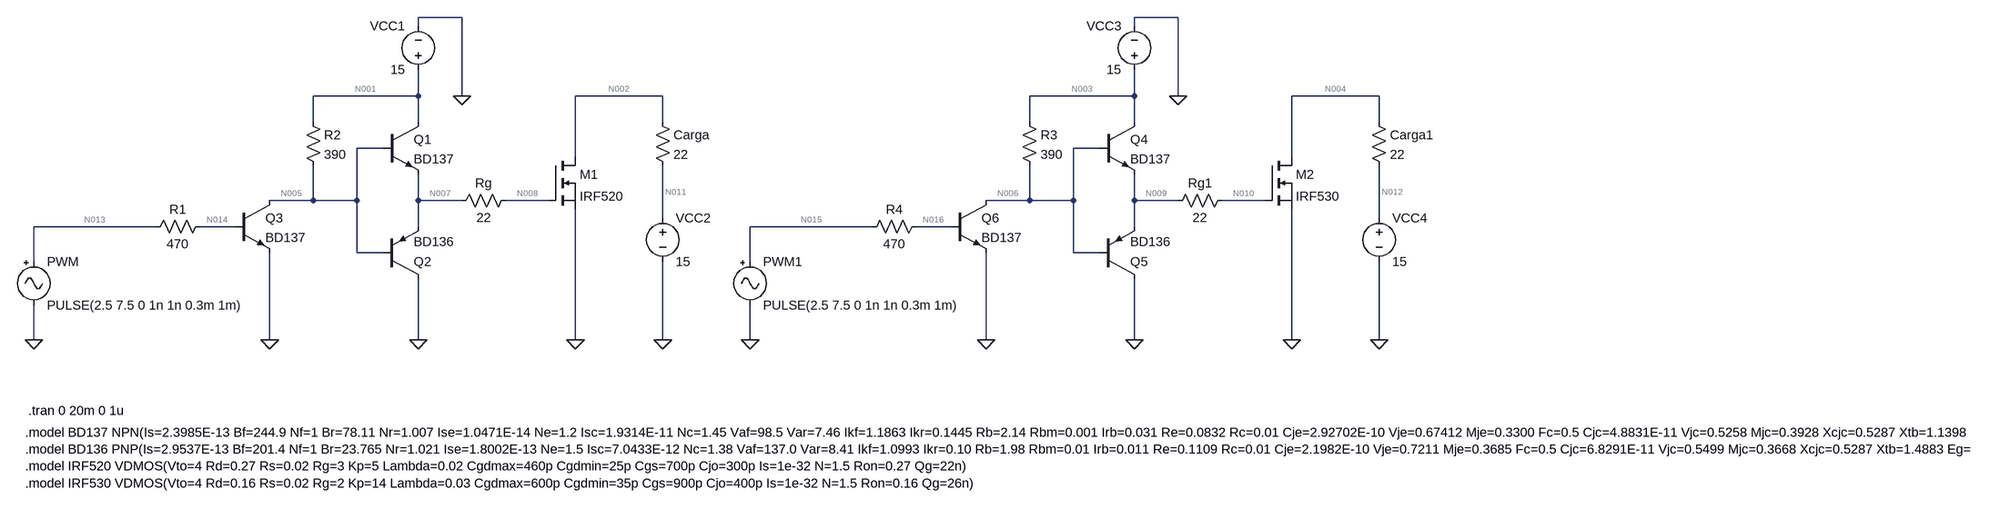
[diagram p0: schematic 1.asc]
1.asc, the LTspice schematic file:
Version 4
SHEET 1 3628 2340
WIRE 240 -144 160 -144
WIRE 1552 -144 1472 -144
WIRE 160 -128 160 -144
WIRE 1472 -128 1472 -144
WIRE 160 0 160 -48
WIRE 160 0 -32 0
WIRE 240 0 240 -144
WIRE 608 0 448 0
WIRE 1472 0 1472 -48
WIRE 1472 0 1280 0
WIRE 1552 0 1552 -144
WIRE 1920 0 1760 0
WIRE -32 48 -32 0
WIRE 160 48 160 0
WIRE 608 48 608 0
WIRE 1280 48 1280 0
WIRE 1472 48 1472 0
WIRE 1920 48 1920 0
WIRE 96 96 48 96
WIRE 1408 96 1360 96
WIRE 448 112 448 0
WIRE 1760 112 1760 0
WIRE -32 192 -32 128
WIRE -32 192 -112 192
WIRE 48 192 48 96
WIRE 48 192 -32 192
WIRE 160 192 160 144
WIRE 240 192 160 192
WIRE 400 192 320 192
WIRE 1280 192 1280 128
WIRE 1280 192 1200 192
WIRE 1360 192 1360 96
WIRE 1360 192 1280 192
WIRE 1472 192 1472 144
WIRE 1552 192 1472 192
WIRE 1712 192 1632 192
WIRE 608 224 608 128
WIRE 1920 224 1920 128
WIRE -320 240 -544 240
WIRE -176 240 -240 240
WIRE 160 240 160 192
WIRE 992 240 768 240
WIRE 1136 240 1072 240
WIRE 1472 240 1472 192
WIRE 48 288 48 192
WIRE 96 288 48 288
WIRE 1360 288 1360 192
WIRE 1408 288 1360 288
WIRE -544 304 -544 240
WIRE 768 304 768 240
WIRE -544 448 -544 384
WIRE -112 448 -112 288
WIRE 160 448 160 336
WIRE 448 448 448 208
WIRE 608 448 608 304
WIRE 768 448 768 384
WIRE 1200 448 1200 288
WIRE 1472 448 1472 336
WIRE 1760 448 1760 208
WIRE 1920 448 1920 304
FLAG 160 448 0
FLAG -112 448 0
FLAG 448 448 0
FLAG 240 0 0
FLAG 608 448 0
FLAG -544 448 0
FLAG 1472 448 0
FLAG 1200 448 0
FLAG 1760 448 0
FLAG 1552 0 0
FLAG 1920 448 0
FLAG 768 448 0
SYMBOL npn 96 48 R0
SYMATTR InstName Q1
SYMATTR Value BD137
SYMBOL pnp 96 336 M180
SYMATTR InstName Q2
SYMATTR Value BD136
SYMBOL res -48 32 R0
SYMATTR InstName R2
SYMATTR Value 390
SYMBOL npn -176 192 R0
SYMATTR InstName Q3
SYMATTR Value BD137
SYMBOL res -224 224 R90
WINDOW 0 0 56 VBottom 2
WINDOW 3 32 56 VTop 2
SYMATTR InstName R1
SYMATTR Value 470
SYMBOL voltage 160 -32 R180
WINDOW 0 24 96 Left 2
WINDOW 3 24 16 Left 2
SYMATTR InstName VCC1
SYMATTR Value 15
SYMBOL res 336 176 R90
WINDOW 0 0 56 VBottom 2
WINDOW 3 32 56 VTop 2
SYMATTR InstName Rg
SYMATTR Value 22
SYMBOL nmos 400 112 R0
SYMATTR InstName M1
SYMATTR Value IRF520
SYMBOL res 592 32 R0
SYMATTR InstName Carga
SYMATTR Value 22
SYMBOL voltage 608 208 R0
SYMATTR InstName VCC2
SYMATTR Value 15
SYMBOL Misc\\signal -544 288 R0
WINDOW 123 0 0 Left 0
WINDOW 39 0 0 Left 0
SYMATTR InstName PWM
SYMATTR Value PULSE(2.5 7.5 0 1n 1n 0.3m 1m)
SYMBOL npn 1408 48 R0
SYMATTR InstName Q4
SYMATTR Value BD137
SYMBOL pnp 1408 336 M180
SYMATTR InstName Q5
SYMATTR Value BD136
SYMBOL res 1264 32 R0
SYMATTR InstName R3
SYMATTR Value 390
SYMBOL npn 1136 192 R0
SYMATTR InstName Q6
SYMATTR Value BD137
SYMBOL res 1088 224 R90
WINDOW 0 0 56 VBottom 2
WINDOW 3 32 56 VTop 2
SYMATTR InstName R4
SYMATTR Value 470
SYMBOL voltage 1472 -32 R180
WINDOW 0 24 96 Left 2
WINDOW 3 24 16 Left 2
SYMATTR InstName VCC3
SYMATTR Value 15
SYMBOL res 1648 176 R90
WINDOW 0 0 56 VBottom 2
WINDOW 3 32 56 VTop 2
SYMATTR InstName Rg1
SYMATTR Value 22
SYMBOL nmos 1712 112 R0
SYMATTR InstName M2
SYMATTR Value IRF530
SYMBOL res 1904 32 R0
SYMATTR InstName Carga1
SYMATTR Value 22
SYMBOL voltage 1920 208 R0
SYMATTR InstName VCC4
SYMATTR Value 15
SYMBOL Misc\\signal 768 288 R0
WINDOW 123 0 0 Left 0
WINDOW 39 0 0 Left 0
SYMATTR InstName PWM1
SYMATTR Value PULSE(2.5 7.5 0 1n 1n 0.3m 1m)
TEXT -554 584 Left 2 !.tran 0 20m 0 1u
TEXT -560 624 Left 2 !.model BD137 NPN(Is=2.3985E-13 Bf=244.9 Nf=1 Br=78.11 Nr=1.007 Ise=1.0471E-14 Ne=1.2 Isc=1.9314E-11 Nc=1.45 Vaf=98.5 Var=7.46 Ikf=1.1863 Ikr=0.1445 Rb=2.14 Rbm=0.001 Irb=0.031 Re=0.0832 Rc=0.01 Cje=2.92702E-10 Vje=0.67412 Mje=0.3300 Fc=0.5 Cjc=4.8831E-11 Vjc=0.5258 Mjc=0.3928 Xcjc=0.5287 Xtb=1.1398 Eg=1.2105 Xti=3.0)\n.model BD136 PNP(Is=2.9537E-13 Bf=201.4 Nf=1 Br=23.765 Nr=1.021 Ise=1.8002E-13 Ne=1.5 Isc=7.0433E-12 Nc=1.38 Vaf=137.0 Var=8.41 Ikf=1.0993 Ikr=0.10 Rb=1.98 Rbm=0.01 Irb=0.011 Re=0.1109 Rc=0.01 Cje=2.1982E-10 Vje=0.7211 Mje=0.3685 Fc=0.5 Cjc=6.8291E-11 Vjc=0.5499 Mjc=0.3668 Xcjc=0.5287 Xtb=1.4883 Eg=1.2343 Xti=3.0)\n.model IRF520 VDMOS(Vto=4 Rd=0.27 Rs=0.02 Rg=3 Kp=5 Lambda=0.02 Cgdmax=460p Cgdmin=25p Cgs=700p Cjo=300p Is=1e-32 N=1.5 Ron=0.27 Qg=22n)\n.model IRF530 VDMOS(Vto=4 Rd=0.16 Rs=0.02 Rg=2 Kp=14 Lambda=0.03 Cgdmax=600p Cgdmin=35p Cgs=900p Cjo=400p Is=1e-32 N=1.5 Ron=0.16 Qg=26n)

The netlist it stands for:
* 1.asc
Q1 N001 N005 N007 0 BD137
Q2 0 N005 N007 0 BD136
R2 N001 N005 390
Q3 N005 N014 0 0 BD137
R1 N014 N013 470
VCC1 N001 0 15
Rg N008 N007 22
M1 N002 N008 0 0 IRF520
R§Carga N002 N011 22
VCC2 N011 0 15
V§PWM N013 0 PULSE(2.5 7.5 0 1n 1n 0.3m 1m)
Q4 N003 N006 N009 0 BD137
Q5 0 N006 N009 0 BD136
R3 N003 N006 390
Q6 N006 N016 0 0 BD137
R4 N016 N015 470
VCC3 N003 0 15
Rg1 N010 N009 22
M2 N004 N010 0 0 IRF530
R§Carga1 N004 N012 22
VCC4 N012 0 15
V§PWM1 N015 0 PULSE(2.5 7.5 0 1n 1n 0.3m 1m)
.model NPN NPN
.model PNP PNP
.lib standard.bjt
.model NMOS NMOS
.model PMOS PMOS
.lib standard.mos
.tran 0 20m 0 1u
.model BD137 NPN(Is=2.3985E-13 Bf=244.9 Nf=1 Br=78.11 Nr=1.007 Ise=1.0471E-14 Ne=1.2 Isc=1.9314E-11 Nc=1.45 Vaf=98.5 Var=7.46 Ikf=1.1863 Ikr=0.1445 Rb=2.14 Rbm=0.001 Irb=0.031 Re=0.0832 Rc=0.01 Cje=2.92702E-10 Vje=0.67412 Mje=0.3300 Fc=0.5 Cjc=4.8831E-11 Vjc=0.5258 Mjc=0.3928 Xcjc=0.5287 Xtb=1.1398 Eg=1.2105 Xti=3.0)
.model BD136 PNP(Is=2.9537E-13 Bf=201.4 Nf=1 Br=23.765 Nr=1.021 Ise=1.8002E-13 Ne=1.5 Isc=7.0433E-12 Nc=1.38 Vaf=137.0 Var=8.41 Ikf=1.0993 Ikr=0.10 Rb=1.98 Rbm=0.01 Irb=0.011 Re=0.1109 Rc=0.01 Cje=2.1982E-10 Vje=0.7211 Mje=0.3685 Fc=0.5 Cjc=6.8291E-11 Vjc=0.5499 Mjc=0.3668 Xcjc=0.5287 Xtb=1.4883 Eg=1.2343 Xti=3.0)
.model IRF520 VDMOS(Vto=4 Rd=0.27 Rs=0.02 Rg=3 Kp=5 Lambda=0.02 Cgdmax=460p Cgdmin=25p Cgs=700p Cjo=300p Is=1e-32 N=1.5 Ron=0.27 Qg=22n)
.model IRF530 VDMOS(Vto=4 Rd=0.16 Rs=0.02 Rg=2 Kp=14 Lambda=0.03 Cgdmax=600p Cgdmin=35p Cgs=900p Cjo=400p Is=1e-32 N=1.5 Ron=0.16 Qg=26n)
.backanno
.end

* Results of the author's LTspice run, read from the files saved beside the schematic
* Operating Point, zero values left out:
*   V(n001) = 15 V
*   V(n005) = 14.42 mV
*   V(n007) = 19.55 mV
*   V(n014) = 713.2 mV
*   V(n013) = 2.5 V
*   V(n008) = 19.55 mV
*   V(n002) = 15 V
*   V(n011) = 15 V
*   V(n003) = 15 V
*   V(n006) = 14.42 mV
*   V(n009) = 19.55 mV
*   V(n016) = 713.2 mV
*   V(n015) = 2.5 V
*   V(n010) = 19.55 mV
*   V(n004) = 15 V
*   V(n012) = 15 V
*   Ic(Q5) = -2.549 pA
*   Ib(Q5) = 2.329 pA
*   Ic(Q2) = -2.549 pA
*   Ib(Q2) = 2.329 pA
*   Ic(Q6) = 38.42 mA
*   Ib(Q6) = 3.802 mA
*   Ie(Q6) = -42.23 mA
*   Ic(Q4) = 34.64 pA
*   Ib(Q4) = -34.31 pA
*   Ic(Q3) = 38.42 mA
*   Ib(Q3) = 3.802 mA
*   Ie(Q3) = -42.23 mA
*   Ic(Q1) = 34.64 pA
*   Ib(Q1) = -34.31 pA
*   Id(M2) = 15 pA
*   Is(M2) = -15 pA
*   Id(M1) = 15 pA
*   Is(M1) = -15 pA
*   I(Carga1) = -30 pA
*   I(R4) = -3.802 mA
*   I(R3) = 38.42 mA
*   I(Carga) = -30 pA
*   I(R1) = -3.802 mA
*   I(R2) = 38.42 mA
*   I(Pwm1) = -3.802 mA
*   I(Vcc4) = -30 pA
*   I(Vcc3) = -38.42 mA
*   I(Pwm) = -3.802 mA
*   I(Vcc2) = -30 pA
*   I(Vcc1) = -38.42 mA
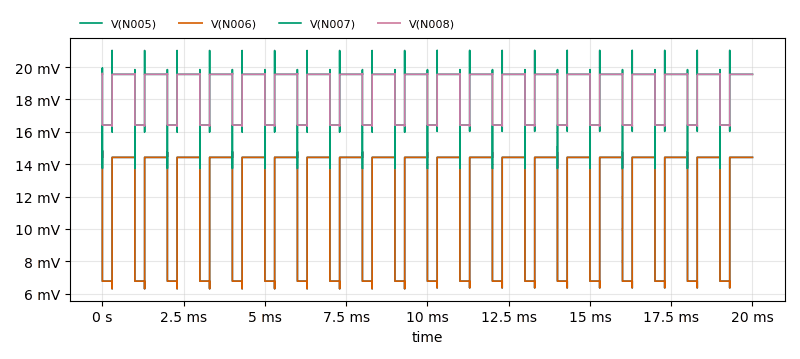
[diagram p1: Transient Analysis of 1.asc, plotted from the saved traces]
* Transient Analysis, 1 run:
*   V(N005): min 6.296 mV, max 14.86 mV, average 12.12 mV, rms 12.62 mV, last 14.42 mV
*   V(N006): min 6.296 mV, max 14.86 mV, average 12.12 mV, rms 12.62 mV, last 14.42 mV
*   V(N007): min 13.73 mV, max 21.03 mV, average 18.61 mV, rms 18.67 mV, last 19.55 mV
*   V(N008): min 16.35 mV, max 19.61 mV, average 18.61 mV, rms 18.67 mV, last 19.55 mV